# Altium schematic sheet Battery charging module.SchDoc
size A; Author: NVK; DrawnBy: NVK; SheetNumber: 1; SheetTotal: 1
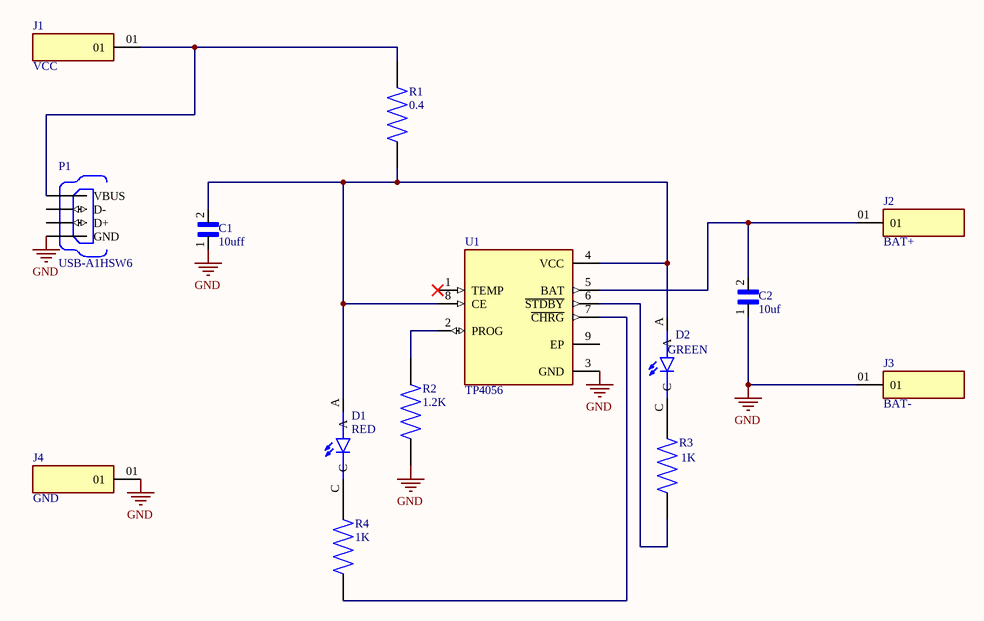
[diagram p0: Battery charging module.SchDoc]

## Parts
C1  10uff  [CAPC2012X145N]
C2  10uf  [CAPC2012X145N]
D1  RED  [LEDC3216X110]
D2  GREEN  [LEDC3216X110]
J1  VCC  [SAMTEC_TMS-101-21-G-S]
J2  BAT+  [SAMTEC_TMS-101-21-G-S]
J3  BAT-  [SAMTEC_TMS-101-21-G-S]
J4  GND  [SAMTEC_TMS-101-21-G-S]
P1  USB-A1HSW6  [OST_USB-A1HSW6]
R1  0.4  [RESC5025X65N]
R2  1.2K  [RES_ERJP03D1201V]
R3  1K  [RESC2012X65N]
R4  1K  [RESC2012X65N]
U1  TP4056  [SOP127P600X175-9N]

## Nets
GND: C1.1 C2.1 J3.01 J4.01 P1.4(GND) R2.1 U1.3(GND)
NetC1_2: C1.2 D1.A D2.A R1.1 U1.4(VCC) U1.8(CE)
NetC2_2: C2.2 J2.01 U1.5(BAT)
NetD1_C: D1.C R4.2
NetD2_C: D2.C R3.2
NetJ1_01: J1.01 P1.1(VBUS) R1.2
NetR2_2: R2.2 U1.2(PROG)
NetR3_1: R3.1 U1.6(~{STDBY})
NetR4_1: R4.1 U1.7(~{CHRG})

Not connected (* = marked no-connect by the designer): P1 2(D-) 3(D+); U1 1(TEMP)* 9(EP)

## Library data of the parts
C1 C2 = GRM21BC81E106ME11L: Package: None; Price: None; Value: *; MP: GRM21BC81E106ME11L; Availability: Unavailable
D1 D2 = LTST-C230KRKT: Red 631nm LED Indication - Discrete 2V 1206 _3216 Metric_; MF: Lite-On Inc.; Digi-Key_Purchase_URL: https://www.digikey.com/product-detail/en/lite-on-inc/LTST-C230KRKT/160-1457-1-ND/386856?utm_source=snapeda&utm_medium=aggregator&utm_campaign=symbol; Digi-Key_Part_Number: 160-1457-1-ND; Package: 1206 Lite-On; SnapEDA_Link: https://www.snapeda.com/parts/LTST-C230KRKT/Lite-On%20Inc./view-part/358143/?ref=snap; MP: LTST-C230KRKT; Value: *
J1-J4 = TMS-101-21-G-S: Package: None; Price: None; Value: *; MP: TMS-101-21-G-S; Availability: Unavailable
P1 = USB-A1HSW6: USB - A Receptacle Connector 4 Position Through Hole, Right Angle; Price: None; Package: None; Availability: Unavailable; MP: USB-A1HSW6; Value: *
R1 = RL2010JK-070R4L: RES SMD 400 MOHM 5% 3/4W 2010; Package: None; Price: None; Value: *; MP: RL2010JK-070R4L; Availability: Unavailable
R2 = ERJP03D1201V: Value: *; Price: None; MP: ERJP03D1201V; Package: None; Availability: Unavailable
R3 R4 = RN73C2A1K0BTG: RESISTOR, THIN FILM, 1K, 0.1%, 0805; Voltage_Rating: 100 V; MF: TE Connectivity; Power_Rating: .1 W; Tolerance: .1%; Package: 0805; Resistance: 1K; SnapEDA_Link: https://www.snapeda.com/parts/RN73C2A1K0BTG/TE%20Connectivity/view-part/613380/?ref=snap; DigiKey-Purchase-URL: https://snapeda.com/shop?store=DigiKey&id=613380; EU_RoHS_Compliance: Compliant; MP: RN73C2A1K0BTG; Price: None; Availability: Unavailable; Value: *
U1 = TP4056: Complete single cell Li-Ion battery with a constant current / constant voltage linear charger; Package: None; MP: TP4056; Value: *; Price: None; Availability: Unavailable